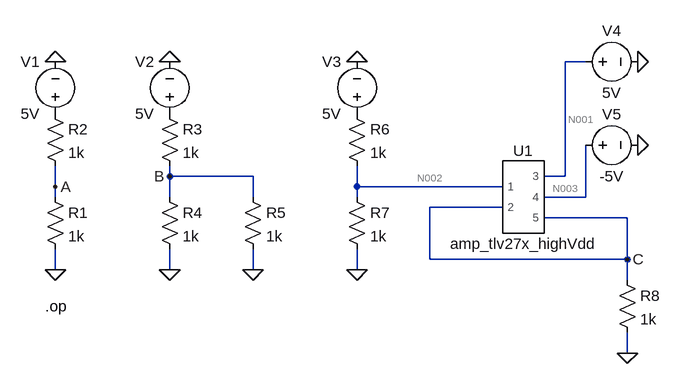
[diagram p0: schematic Pre-Lab-1.asc]
Pre-Lab-1.asc, the LTspice schematic file:
Version 4.1
SHEET 1 1224 680
WIRE 928 -128 896 -128
WIRE 288 48 288 32
WIRE 416 48 288 48
WIRE 896 48 896 -128
WIRE 896 48 864 48
WIRE 112 64 112 32
WIRE 576 64 576 32
WIRE 800 64 576 64
WIRE 112 80 112 64
WIRE 288 80 288 48
WIRE 416 80 416 48
WIRE 576 80 576 64
WIRE 928 80 928 0
WIRE 928 80 864 80
WIRE 800 96 688 96
WIRE 992 112 864 112
WIRE 688 176 688 96
WIRE 992 176 992 112
WIRE 992 176 688 176
WIRE 112 192 112 160
WIRE 288 192 288 160
WIRE 416 192 416 160
WIRE 576 192 576 160
WIRE 992 208 992 176
WIRE 992 320 992 288
FLAG 112 192 0
FLAG 112 -128 0
FLAG 288 -128 0
FLAG 288 192 0
FLAG 416 192 0
FLAG 112 64 A
FLAG 288 48 B
FLAG 576 -128 0
FLAG 576 192 0
FLAG 992 320 0
FLAG 992 176 C
FLAG 1008 -128 0
FLAG 1008 0 0
SYMBOL res 96 64 R0
SYMATTR InstName R1
SYMATTR Value 1k
SYMBOL res 96 -64 R0
SYMATTR InstName R2
SYMATTR Value 1k
SYMBOL res 272 -64 R0
SYMATTR InstName R3
SYMATTR Value 1k
SYMBOL res 272 64 R0
SYMATTR InstName R4
SYMATTR Value 1k
SYMBOL res 400 64 R0
SYMATTR InstName R5
SYMATTR Value 1k
SYMBOL res 560 -64 R0
SYMATTR InstName R6
SYMATTR Value 1k
SYMBOL res 560 64 R0
SYMATTR InstName R7
SYMATTR Value 1k
SYMBOL res 976 192 R0
SYMATTR InstName R8
SYMATTR Value 1k
SYMBOL voltage 112 -32 R180
WINDOW 0 24 96 Left 2
WINDOW 3 24 16 Left 2
WINDOW 123 0 0 Left 0
WINDOW 39 0 0 Left 0
SYMATTR InstName V1
SYMATTR Value 5V
SYMBOL voltage 288 -32 R180
WINDOW 0 24 96 Left 2
WINDOW 3 24 16 Left 2
WINDOW 123 0 0 Left 0
WINDOW 39 0 0 Left 0
SYMATTR InstName V2
SYMATTR Value 5V
SYMBOL amp_tlv27x_highVdd1 832 80 R0
SYMATTR InstName U1
SYMBOL voltage 576 -32 R180
WINDOW 0 24 96 Left 2
WINDOW 3 24 16 Left 2
WINDOW 123 0 0 Left 0
WINDOW 39 0 0 Left 0
SYMATTR InstName V3
SYMATTR Value 5V
SYMBOL voltage 912 -128 R270
WINDOW 0 32 56 VTop 2
WINDOW 3 -32 56 VBottom 2
WINDOW 123 0 0 Left 0
WINDOW 39 0 0 Left 0
SYMATTR InstName V4
SYMATTR Value 5V
SYMBOL voltage 912 0 R270
WINDOW 0 32 56 VTop 2
WINDOW 3 -32 56 VBottom 2
WINDOW 123 0 0 Left 0
WINDOW 39 0 0 Left 0
SYMATTR InstName V5
SYMATTR Value -5V
TEXT 96 248 Left 2 !.op

The netlist it stands for:
* Pre-Lab-1.asc
R1 A 0 1k
R2 P001 A 1k
R3 P002 B 1k
R4 B 0 1k
R5 B 0 1k
R6 P003 N002 1k
R7 N002 0 1k
R8 C 0 1k
V1 P001 0 5V
V2 P002 0 5V
X§U1 N002 C N001 N003 C amp_tlv27x_highVdd  ; pins 1 2 3 4 5
V3 P003 0 5V
V4 N001 0 5V
V5 N003 0 -5V
.op
.lib TLV271.LIB
.backanno
.end

* Results of the author's LTspice run, read from the files saved beside the schematic
* Operating Point:
*   V(a) = 2.5 V
*   V(b) = 1.667 V
*   V(c) = 2.499 V
*   V(n001) = 5 V
*   V(n002) = 2.5 V
*   V(n003) = -5 V
*   V(p001) = 5 V
*   V(p002) = 5 V
*   V(p003) = 5 V
*   I(R1) = 2.5 mA
*   I(R2) = 2.5 mA
*   I(R3) = 3.333 mA
*   I(R4) = 1.667 mA
*   I(R5) = 1.667 mA
*   I(R6) = 2.5 mA
*   I(R7) = 2.5 mA
*   I(R8) = 2.499 mA
*   I(V1) = -2.5 mA
*   I(V2) = -3.333 mA
*   I(V3) = -2.5 mA
*   I(V4) = -67.8 µA
*   I(V5) = 67.78 µA
*   Ix(u1:1) = -4.398 pA
*   Ix(u1:2) = -4.402 pA
*   Ix(u1:3) = 67.8 µA
*   Ix(u1:4) = -67.78 µA
*   Ix(u1:5) = -2.499 mA